# Altium schematic sheet KS2E_PRECHARGE.SchDoc
size A; SheetNumber: 1; SheetTotal: 3
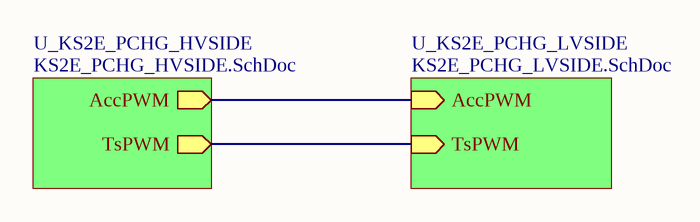
[diagram p0: KS2E_PRECHARGE.SchDoc]

## Sub-sheets
U_KS2E_PCHG_HVSIDE = KS2E_PCHG_HVSIDE.SchDoc: TsPWM (out), AccPWM (out)
U_KS2E_PCHG_LVSIDE = KS2E_PCHG_LVSIDE.SchDoc: AccPWM (in), TsPWM (in)

## Nets
(unnamed): sheet U_KS2E_PCHG_HVSIDE/TsPWM, sheet U_KS2E_PCHG_LVSIDE/TsPWM
(unnamed): sheet U_KS2E_PCHG_HVSIDE/AccPWM, sheet U_KS2E_PCHG_LVSIDE/AccPWM